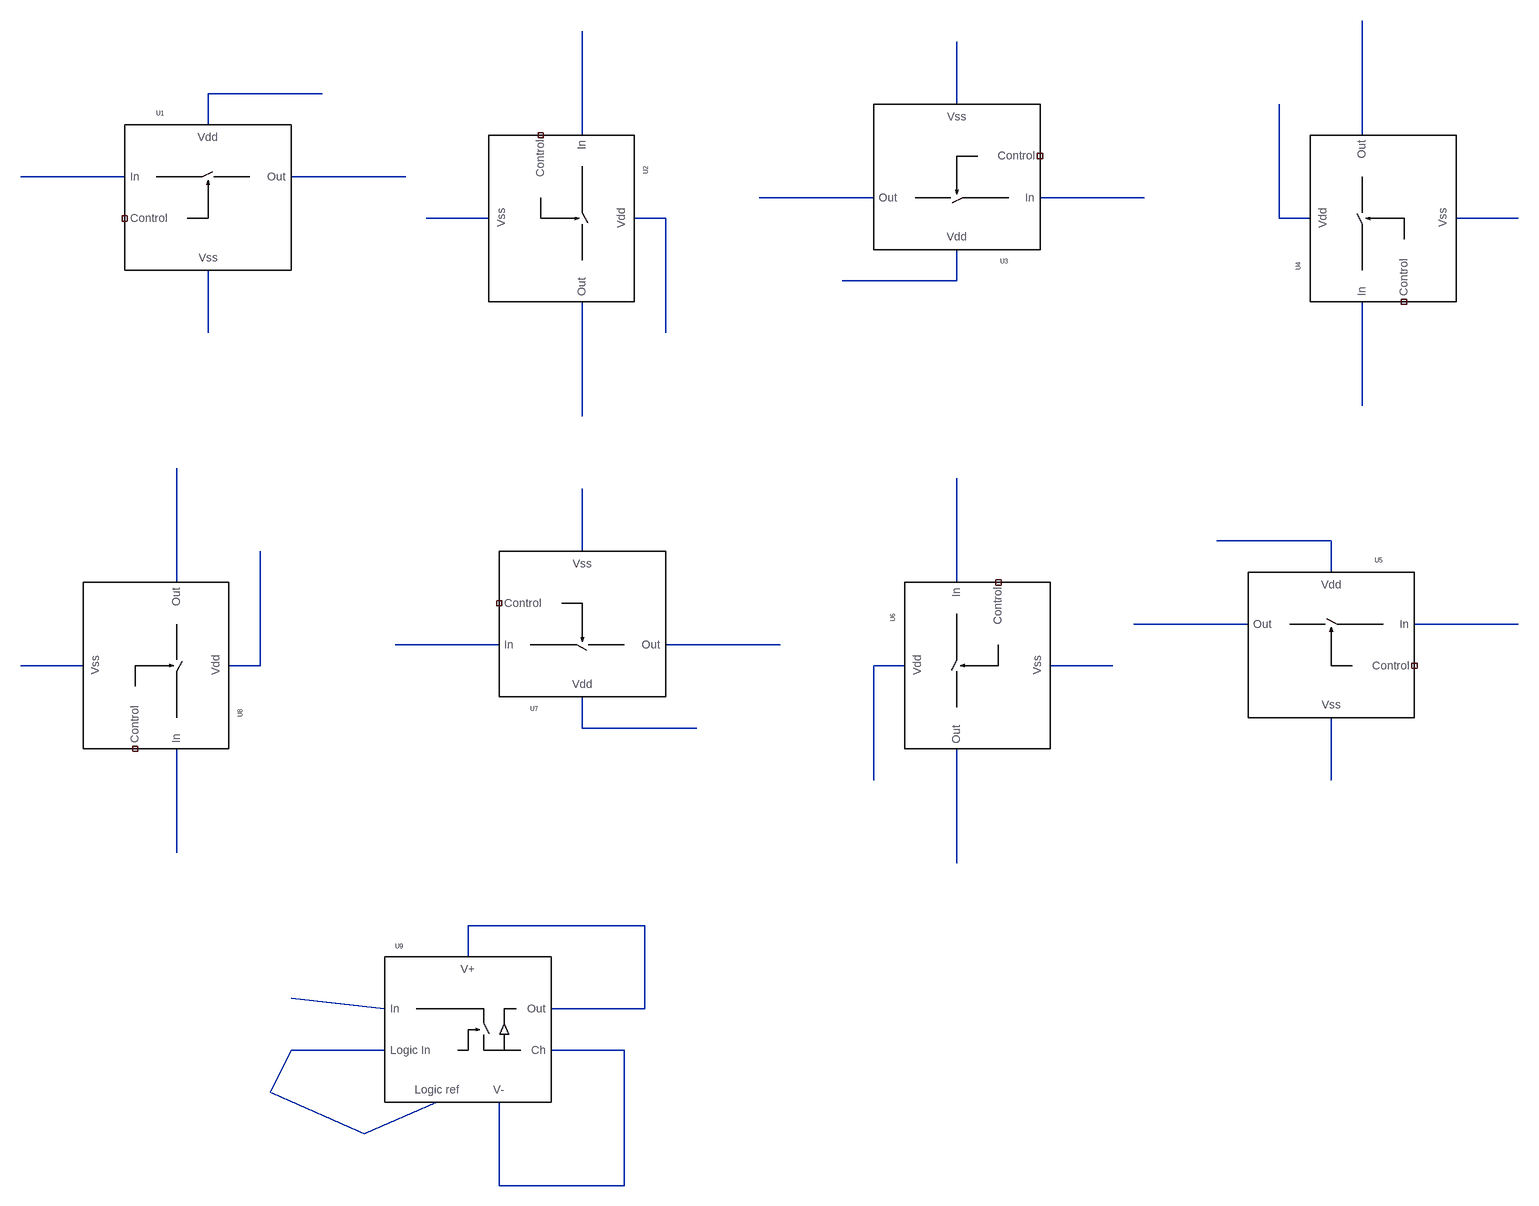
[diagram p0: schematic 31 - ASSD Weird Symbols.asc]
31 - ASSD Weird Symbols.asc, the LTspice schematic file:
Version 4.1
SHEET 1 2724 2276
WIRE 352 592 176 592
WIRE 1328 608 1328 512
WIRE 176 640 176 592
WIRE 752 656 752 496
WIRE 1952 656 1952 480
WIRE 48 720 -112 720
WIRE 480 720 304 720
WIRE 1200 752 1024 752
WIRE 1616 752 1456 752
WIRE 608 784 512 784
WIRE 880 784 832 784
WIRE 1824 784 1824 608
WIRE 1872 784 1824 784
WIRE 2192 784 2096 784
WIRE 1328 880 1328 832
WIRE 1328 880 1152 880
WIRE 176 960 176 864
WIRE 880 960 880 784
WIRE 1952 1072 1952 912
WIRE 752 1088 752 912
WIRE 1904 1280 1728 1280
WIRE 752 1296 752 1200
WIRE 1904 1328 1904 1280
WIRE 128 1344 128 1168
WIRE 1328 1344 1328 1184
WIRE 1776 1408 1600 1408
WIRE 2192 1408 2032 1408
WIRE 624 1440 464 1440
WIRE 1056 1440 880 1440
WIRE -16 1472 -112 1472
WIRE 256 1472 256 1296
WIRE 256 1472 208 1472
WIRE 1248 1472 1200 1472
WIRE 1568 1472 1472 1472
WIRE 752 1568 752 1520
WIRE 928 1568 752 1568
WIRE 1200 1648 1200 1472
WIRE 1904 1648 1904 1552
WIRE 128 1760 128 1600
WIRE 1328 1776 1328 1600
WIRE 848 1872 576 1872
WIRE 576 1920 576 1872
WIRE 448 2000 304 1984
WIRE 848 2000 848 1872
WIRE 848 2000 704 2000
WIRE 448 2064 304 2064
WIRE 816 2064 704 2064
WIRE 272 2128 304 2064
WIRE 416 2192 272 2128
WIRE 416 2192 528 2144
WIRE 624 2272 624 2144
WIRE 816 2272 816 2064
WIRE 816 2272 624 2272
SYMBOL TCLib\\ASSD\\ASSD_CD4016B 48 640 R0
SYMATTR InstName U1
SYMBOL TCLib\\ASSD\\ASSD_CD4016B 832 656 R90
SYMATTR InstName U2
SYMBOL TCLib\\ASSD\\ASSD_CD4016B 1456 832 R180
SYMATTR InstName U3
SYMBOL TCLib\\ASSD\\ASSD_CD4016B 1872 912 R270
SYMATTR InstName U4
SYMBOL TCLib\\ASSD\\ASSD_CD4016B 2032 1328 M0
SYMATTR InstName U5
SYMBOL TCLib\\ASSD\\ASSD_CD4016B 1248 1344 M90
SYMATTR InstName U6
SYMBOL TCLib\\ASSD\\ASSD_CD4016B 624 1520 M180
SYMATTR InstName U7
SYMBOL TCLib\\ASSD\\ASSD_CD4016B 208 1600 M270
SYMATTR InstName U8
SYMBOL TCLib\\ASSD\\ASSD_LF398 448 1920 R0
SYMATTR InstName U9

The netlist it stands for:
* 31 - ASSD Weird Symbols.asc
X§U1 N005 N006 NC_01 N001 N014 ASSD_CD4016B  ; pins In Out Control Vdd Vss
X§U2 N003 N016 NC_02 N010 N009 ASSD_CD4016B  ; pins In Out Control Vdd Vss
X§U3 N008 N007 NC_03 N013 N002 ASSD_CD4016B  ; pins In Out Control Vdd Vss
X§U4 N015 N004 NC_04 N011 N012 ASSD_CD4016B  ; pins In Out Control Vdd Vss
X§U5 N022 N021 NC_05 N017 N030 ASSD_CD4016B  ; pins In Out Control Vdd Vss
X§U6 N020 N032 NC_06 N027 N028 ASSD_CD4016B  ; pins In Out Control Vdd Vss
X§U7 N023 N024 NC_07 N029 N018 ASSD_CD4016B  ; pins In Out Control Vdd Vss
X§U8 N031 N019 NC_08 N026 N025 ASSD_CD4016B  ; pins In Out Control Vdd Vss
X§U9 N034 N035 N035 N036 N036 N033 N033 ASSD_LF398  ; pins In Logic_In Logic_ref V- Ch Out V+
.lib TCLib/ASSD_CD4016B.lib
.lib TCLib/ASSD_LF398.lib
.backanno
.end